# EAGLE design RAMPS_18 (EAGLE 7.3.0)
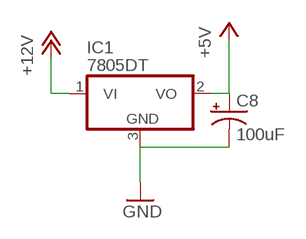
[diagram p0: schematic, sheet 1, part 1 of 2]
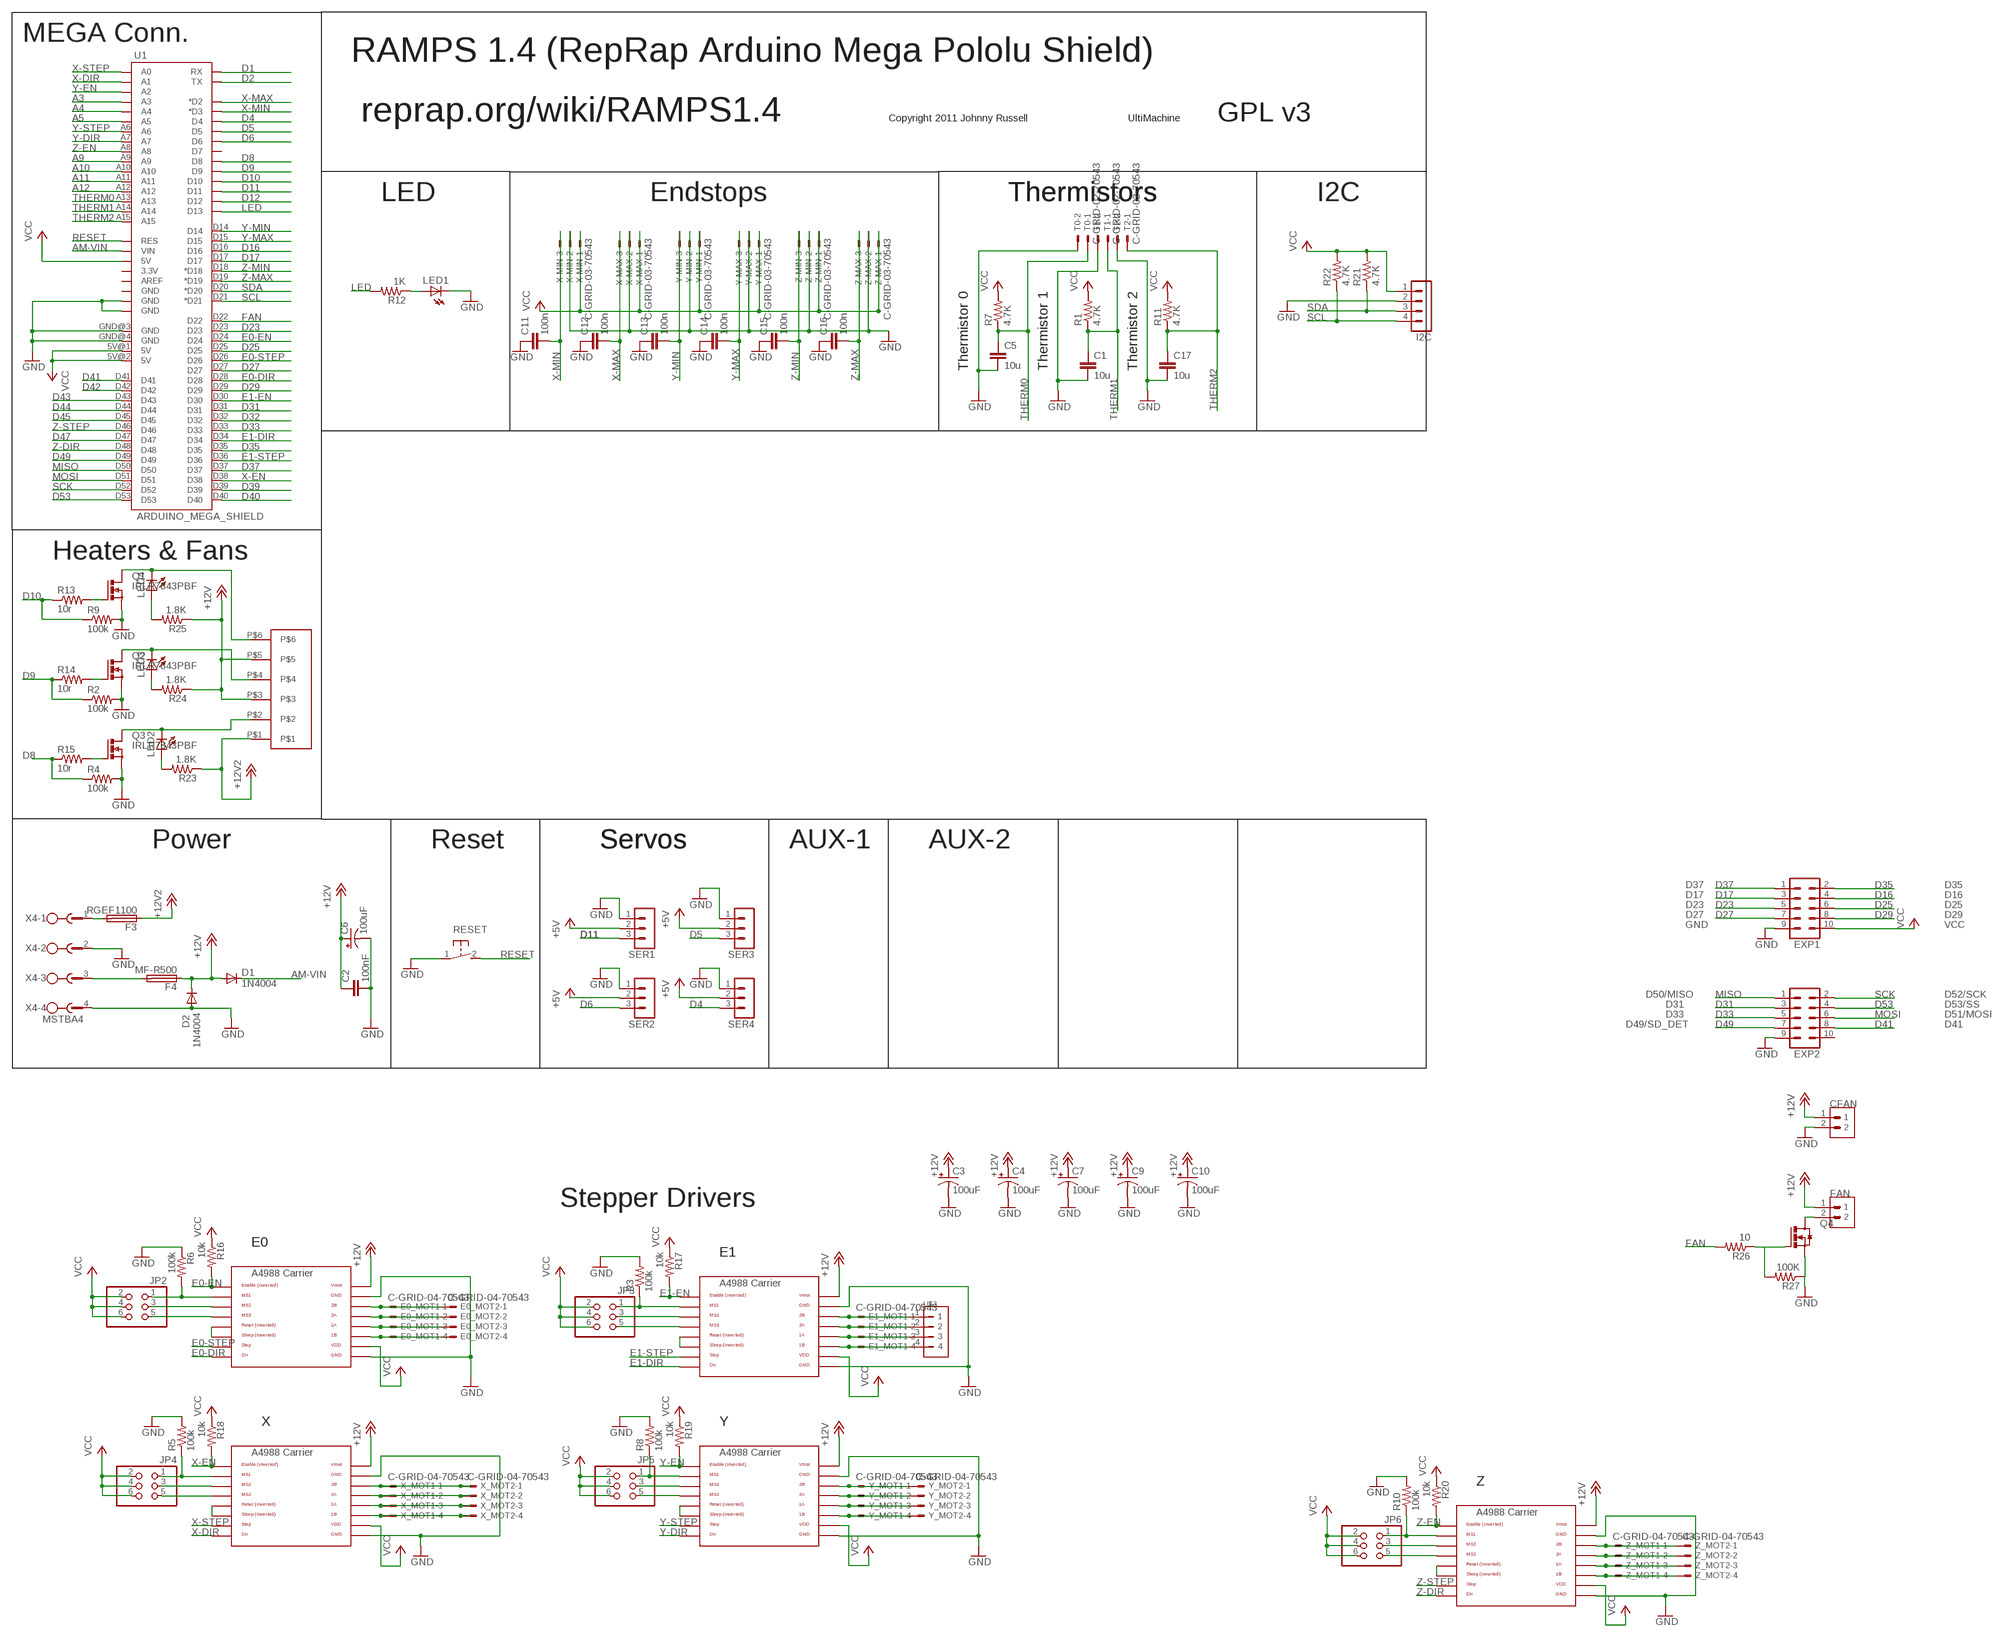
[diagram p1: schematic, sheet 1, part 2 of 2]

## Parts
C1  10u  C-EUC1206  [C1206]
C2  100nF  C-EUC0805  [C0805]
C3  100uF  CPOL-US153CLV-0605  [153CLV-0605]
C4  100uF  CPOL-US153CLV-0605  [153CLV-0605]
C5  10u  C-EUC1206  [C1206]
C6  100uF  CPOL-US153CLV-0605  [153CLV-0605]
C7  100uF  CPOL-US153CLV-0605  [153CLV-0605]
C8  100uF  CPOL-US153CLV-0605  [153CLV-0605]
C9  100uF  CPOL-US153CLV-0605  [153CLV-0605]
C10  100uF  CPOL-US153CLV-0605  [153CLV-0605]
C11  100n  C-EUC0805  [C0805]
C12  100n  C-EUC0805  [C0805]
C13  100n  C-EUC0805  [C0805]
C14  100n  C-EUC0805  [C0805]
C15  100n  C-EUC0805  [C0805]
C16  100n  C-EUC0805  [C0805]
C17  10u  C-EUC1206  [C1206]
CFAN  CWF-2_D  [CWF-2_P]
D1  1N4004  [DO41-10]
D2  1N4004  [DO41-10]
E0_MOT1  C-GRID-04-70543  [70543-04]
E0_MOT2  C-GRID-04-70543  [70543-04]
E1_MOT1  C-GRID-04-70543  [70543-04]
EXP1  MA05-2  [PAK100/2500-10]
EXP2  MA05-2  [PAK100/2500-10]
F3  RGEF1100  [RGEF1100]
F4  MF-R500  [MF-R500]
FAN  CWF-2_D  [CWF-2_P]
HEAT_PORT  282837-6  [282837-6]
I2C  MA04-1  [MA04-1]
IC1  7805DT  [TO252]
JP2  PINHD-2X3  [2X03]
JP3  PINHD-2X3  [2X03]
JP4  PINHD-2X3  [2X03]
JP5  PINHD-2X3  [2X03]
JP6  PINHD-2X3  [2X03]
LED1  LEDCHIP-LED0805  [CHIP-LED0805]
LED2  LEDCHIP-LED0805  [CHIP-LED0805]
LED3  LEDCHIP-LED0805  [CHIP-LED0805]
LED4  LEDCHIP-LED0805  [CHIP-LED0805]
Q1  IRLR7843PBF  D-PAK_N-MOSFET  [D-PAK_TO252AA]
Q2  IRLR7843PBF  D-PAK_N-MOSFET  [D-PAK_TO252AA]
Q3  IRLR7843PBF  D-PAK_N-MOSFET  [D-PAK_TO252AA]
Q4  N_MOSFET_SOT23  [SOT23]
R1  4.7K  R-US_R1206  [R1206]
R2  100k  R-US_R0805  [R0805]
R3  100k  R-US_R1206  [R1206]
R4  100k  R-US_R0805  [R0805]
R5  100k  R-US_R1206  [R1206]
R6  100k  R-US_R1206  [R1206]
R7  4.7K  R-US_R1206  [R1206]
R8  100k  R-US_R1206  [R1206]
R9  100k  R-US_R0805  [R0805]
R10  100k  R-US_R1206  [R1206]
R11  4.7K  R-US_R1206  [R1206]
R12  1K  R-US_R0805  [R0805]
R13  10r  R-US_R0805  [R0805]
R14  10r  R-US_M0805  [M0805]
R15  10r  R-US_R0805  [R0805]
R16  10k  R-US_R1206  [R1206]
R17  10k  R-US_R1206  [R1206]
R18  10k  R-US_R1206  [R1206]
R19  10k  R-US_R1206  [R1206]
R20  10k  R-US_R1206  [R1206]
R21  4.7K  R-US_R1206  [R1206]
R22  4.7K  R-US_R1206  [R1206]
R23  1.8K  R-US_R0805  [R0805]
R24  1.8K  R-US_R0805  [R0805]
R25  1.8K  R-US_R0805  [R0805]
R26  10  R-US_R1206  [R1206]
R27  100K  R-US_R1206  [R1206]
RESET  31-XX  [B3F-31XX]
SER1  3PIN-HEADER  [3PIN-HEADER]
SER2  3PIN-HEADER  [3PIN-HEADER]
SER3  3PIN-HEADER  [3PIN-HEADER]
SER4  3PIN-HEADER  [3PIN-HEADER]
T0  C-GRID-02-70543  [70543-02]
T1  C-GRID-02-70543  [70543-02]
T2  C-GRID-02-70543  [70543-02]
U1  ARDUINO_MEGA_SHIELD  [ARDUINO_MEGA_SHIELD]
U$3  CWF-4_D  [CWF-4_P]
U$4  A4988BREAKOUT  [A4988BREAKOUT]
U$5  A4988BREAKOUT  [A4988BREAKOUT]
U$6  A4988BREAKOUT  [A4988BREAKOUT]
U$7  A4988BREAKOUT  [A4988BREAKOUT]
U$8  A4988BREAKOUT  [A4988BREAKOUT]
X4  MSTBA4  [MSTBA4]
X-MAX  C-GRID-03-70543  [70543-03]
X-MIN  C-GRID-03-70543  [70543-03]
X_MOT1  C-GRID-04-70543  [70543-04]
X_MOT2  C-GRID-04-70543  [70543-04]
Y-MAX  C-GRID-03-70543  [70543-03]
Y-MIN  C-GRID-03-70543  [70543-03]
Y_MOT1  C-GRID-04-70543  [70543-04]
Y_MOT2  C-GRID-04-70543  [70543-04]
Z-MAX  C-GRID-03-70543  [70543-03]
Z-MIN  C-GRID-03-70543  [70543-03]
Z_MOT1  C-GRID-04-70543  [70543-04]
Z_MOT2  C-GRID-04-70543  [70543-04]

## Nets
+5V: C8.+ IC1.2(VO) SER1.2 SER2.2 SER3.2 SER4.2
+12V: C2.1 C3.+ C4.+ C6.+ C7.+ C9.+ C10.+ CFAN.1 D1.A D2.C F4.P$1 FAN.1 HEAT_PORT.P$3 HEAT_PORT.P$5 IC1.1(VI) R24.1 R25.1 U$4.VMOT U$5.VMOT U$6.VMOT U$7.VMOT U$8.VMOT
+12V2: F3.P$1 HEAT_PORT.P$1 R23.1
A3: U1.A3
A4: U1.A4
A5: U1.A5
A9: U1.A9
A10: U1.A10
A11: U1.A11
A12: U1.A12
AM-VIN: D1.C U1.VIN
D1: U1.RX
D2: U1.TX
D4: SER4.3 U1.D4
D5: SER3.3 U1.D5
D6: SER2.3 U1.D6
D8: R4.1 R15.1 U1.D8
D9: R2.1 R14.1 U1.D9
D10: R9.1 R13.1 U1.D10
D11: SER1.3 U1.D11
D12: U1.D12
D16: EXP1.4 U1.D16
D17: EXP1.3 U1.D17
D23: EXP1.5 U1.D23
D25: EXP1.6 U1.D25
D27: EXP1.7 U1.D27
D29: EXP1.8 U1.D29
D31: EXP2.3 U1.D31
D32: U1.D32
D33: EXP2.5 U1.D33
D35: EXP1.2 U1.D35
D37: EXP1.1 U1.D37
D39: U1.D39
D40: U1.D40
D41: EXP2.8 U1.D41
D42: U1.D42
D43: U1.D43
D44: U1.D44
D45: U1.D45
D47: U1.D47
D49: EXP2.7 U1.D49
D53: EXP2.4 U1.D53
E0-DIR: U1.D28 U$4.DIR
E0-EN: R16.2 U1.D24 U$4.EN
E0-STEP: U1.D26 U$4.STEP
E1-DIR: U1.D34 U$5.DIR
E1-EN: R17.2 U1.D30 U$5.EN
E1-STEP: U1.D36 U$5.STEP
FAN: R26.2 U1.D22
GND: C1.2 C2.2 C3.- C4.- C5.2 C6.- C7.- C8.- C9.- C10.- C11.1 C12.1 C13.1 C14.1 C15.1 C16.1 C17.2 CFAN.2 D2.A EXP1.9 EXP2.9 I2C.2 IC1.3(GND) LED1.C Q1.3(S) Q2.3(S) Q3.3(S) Q4.2(S) R2.2 R3.2 R4.2 R5.2 R6.1 R8.2 R9.2 R10.2 R27.1 RESET.1(P) SER1.1 SER2.1 SER3.1 SER4.1 T0.2 T1.2 T2.2 U1.GND@0(GND) U1.GND@1(GND) U1.GND@3(GND) U1.GND@4(GND) U$4.GND U$4.GND@0(GND) U$5.GND U$5.GND@0(GND) U$6.GND U$6.GND@0(GND) U$7.GND U$7.GND@0(GND) U$8.GND U$8.GND@0(GND) X4.2 X4.4 X-MAX.2 X-MIN.2 Y-MAX.2 Y-MIN.2 Z-MAX.2 Z-MIN.2
LED: R12.2 U1.D13
MISO: EXP2.1 U1.D50
MOSI: EXP2.6 U1.D51
N$1: HEAT_PORT.P$4 LED3.C Q2.4(D)
N$3: E0_MOT1.1 E0_MOT2.1 U$4.2B
N$4: E0_MOT1.2 E0_MOT2.2 U$4.2A
N$5: JP2.1 R6.2 U$4.MS1
N$6: JP2.5 U$4.MS3
N$7: HEAT_PORT.P$6 LED4.C Q1.4(D)
N$8: U$4.RST U$4.SLP(SLEEP)
N$9: JP2.3 U$4.MS2
N$10: E0_MOT1.3 E0_MOT2.3 U$4.1A
N$11: E0_MOT1.4 E0_MOT2.4 U$4.1B
N$12: E1_MOT1.1 U$3.1 U$5.2B
N$13: E1_MOT1.2 U$3.2 U$5.2A
N$14: JP4.1 R5.1 U$6.MS1
N$15: JP4.3 U$6.MS2
N$16: E1_MOT1.3 U$3.3 U$5.1A
N$17: JP5.3 U$7.MS2
N$18: E1_MOT1.4 U$3.4 U$5.1B
N$19: JP4.5 U$6.MS3
N$20: U$6.RST U$6.SLP(SLEEP)
N$21: U$6.2B X_MOT1.1 X_MOT2.1
N$22: U$6.2A X_MOT1.2 X_MOT2.2
N$23: U$7.RST U$7.SLP(SLEEP)
N$24: U$5.RST U$5.SLP(SLEEP)
N$25: JP3.1 R3.1 U$5.MS1
N$26: U$6.1A X_MOT1.3 X_MOT2.3
N$27: U$6.1B X_MOT1.4 X_MOT2.4
N$28: U$7.2B Y_MOT1.1 Y_MOT2.1
N$29: U$7.2A Y_MOT1.2 Y_MOT2.2
N$30: U$7.1A Y_MOT1.3 Y_MOT2.3
N$31: JP5.5 U$7.MS3
N$32: LED2.A R23.2
N$33: JP5.1 R8.1 U$7.MS1
N$34: JP3.5 U$5.MS3
N$35: JP3.3 U$5.MS2
N$36: U$7.1B Y_MOT1.4 Y_MOT2.4
N$37: JP6.3 U$8.MS2
N$38: U$8.RST U$8.SLP(SLEEP)
N$39: JP6.5 U$8.MS3
N$40: JP6.1 R10.1 U$8.MS1
N$41: U$8.2B Z_MOT1.1 Z_MOT2.1
N$42: U$8.2A Z_MOT1.2 Z_MOT2.2
N$43: U$8.1A Z_MOT1.3 Z_MOT2.3
N$44: U$8.1B Z_MOT1.4 Z_MOT2.4
N$45: LED3.A R24.2
N$46: LED1.A R12.1
N$47: Q2.1(G) R14.2
N$48: Q1.1(G) R13.2
N$49: Q3.1(G) R15.2
N$50: LED4.A R25.2
N$51: HEAT_PORT.P$2 LED2.C Q3.4(D)
N$53: F3.P$2 X4.1
N$54: F4.P$2 X4.3
N$62: FAN.2 Q4.3(D)
N$63: Q4.1(G) R26.1 R27.2
RESET: RESET.2(S) U1.RES
SCK: EXP2.2 U1.D52
SCL: I2C.4 R22.1 U1.D21(*D21)
SDA: I2C.3 R21.1 U1.D20(*D20)
THERM0: C5.1 R7.1 T0.1 U1.A13
THERM1: C1.1 R1.1 T1.1 U1.A14
THERM2: C17.1 R11.1 T2.1 U1.A15
VCC: EXP1.10 I2C.1 JP2.2 JP2.4 JP2.6 JP3.2 JP3.4 JP3.6 JP4.2 JP4.4 JP4.6 JP5.2 JP5.4 JP5.6 JP6.2 JP6.4 JP6.6 R1.2 R7.2 R11.2 R16.1 R17.1 R18.1 R19.1 R20.1 R21.2 R22.2 U1.5V@0(5V) U1.5V@1(5V) U1.5V@2(5V) U$4.VDD U$5.VDD U$6.VDD U$7.VDD U$8.VDD X-MAX.1 X-MIN.1 Y-MAX.1 Y-MIN.1 Z-MAX.1 Z-MIN.1
X-DIR: U1.A1 U$6.DIR
X-EN: R18.2 U1.D38 U$6.EN
X-MAX: C12.2 U1.D2(*D2) X-MAX.3
X-MIN: C11.2 U1.D3(*D3) X-MIN.3
X-STEP: U1.A0 U$6.STEP
Y-DIR: U1.A7 U$7.DIR
Y-EN: R19.2 U1.A2 U$7.EN
Y-MAX: C14.2 U1.D15 Y-MAX.3
Y-MIN: C13.2 U1.D14 Y-MIN.3
Y-STEP: U1.A6 U$7.STEP
Z-DIR: U1.D48 U$8.DIR
Z-EN: R20.2 U1.A8 U$8.EN
Z-MAX: C16.2 U1.D19(*D19) Z-MAX.3
Z-MIN: C15.2 U1.D18(*D18) Z-MIN.3
Z-STEP: U1.D46 U$8.STEP
Unconnected: EXP2.10 U1.3.3V U1.AREF U1.D7 U1.GND@2(GND)

## Notes on the sheet
- MEGA Conn.
- RAMPS 1.4 (RepRap Arduino Mega Pololu Shield)
- reprap.org/wiki/RAMPS1.4 | Copyright 2011 Johnny Russell | UltiMachine | GPL v3
- LED | Endstops | Thermistors | Thermistors | I2C
- Thermistor 0 | Thermistor 1 | Thermistor 2
- Heaters & Fans
- Power | Reset | Servos | Servos | AUX-1 | AUX-2
- D37 | D35
- D17 | D16
- D23 | D25
- D27 | D29
- GND | VCC
- D50/MISO | D52/SCK
- D31 | D53/SS
- D33 | D51/MOSI
- D49/SD_DET | D41
- Stepper Drivers
- E0
- E1
- X | Y
- Z

## Library data of the parts
C1 C2 C5 C17 = resistor:C-EU: CAPACITOR, European symbol
C3 C4 C6-C10 = adafruit:CPOL-US: POLARIZED CAPACITOR, American symbol
C11-C16 = rcl:C-EU: CAPACITOR, European symbol
CFAN FAN = xSets - Joystick:CWF-2_D
D1 D2 = diode:1N4004: DIODE general purpose rectifier, 1 A
E0_MOT1 E0_MOT2 E1_MOT1 X_MOT1 X_MOT2 Y_MOT1 Y_MOT2 Z_MOT1 Z_MOT2 = con-molex:C-GRID-04: CONNECTOR wire to board 2.54 mm (0.100") pitch header; OC_FARNELL: unknown; OC_NEWARK: unknown
EXP1 EXP2 = xSets - Joystick:MA05-2: PIN HEADER
F3 = xSets - Joystick:RGEF1100
F4 = xSets - Joystick:MF-R500
HEAT_PORT = RepRapjr:282837-6
I2C = con-lstb:MA04-1: PIN HEADER; OC_FARNELL: unknown; OC_NEWARK: unknown
IC1 = linear:78*: Positive VOLTAGE REGULATOR Source: http://cache.national.com/ds/LM/LM78L05.pdf http://www.fairchildsemi.com/ds/LM/LM7805.pdf
JP2-JP6 = pinhead:PINHD-2X3: PIN HEADER
LED1-LED4 = led:LED: LED OSRAM: - CHIPLED LG R971, LG N971, LY N971, LG Q971, LY Q971, LO R971, LY R971 LH N974, LH R974 LS Q976, LO Q976, LY Q976 LO Q996 - Hyper CHIPLED LW Q18S LB Q993, LB Q99A, LB R99A - SideLED LS A670, LO A670, LY A670, LG A670, LP A670 LB A673, LV A673, LT A673, LW A673 LH A674 LY A675 LS A676, LA A676, LO A676, LY A676, LW A676 LS A679, LY A679, LG A679 - Hyper Micro SIDELED® LS Y876, LA Y876, LO Y876, LY Y876 LT Y87S - SmartLED LW L88C, LW L88S LB L89C, LB L89S, LG L890 LS L89K, LO L89K, LY L89K LS L896, LA L896, LO L896, LY L896 - TOPLED LS T670, LO T670, LY T670, LG T670, LP T670 LSG T670, LSP T670, LSY T670, LOP T670, LYG T670 LG T671, LOG T671, LSG T671 LB T673, LV T673, LT T673, LW T673 LH T674 LS T676, LA T676, LO T676, LY T676, LB T676, LH T676, LSB T676, LW T676 LB T67C, LV T67C, LT T67C, LS T67K, LO T67K, LY T67K, LW E67C LS E67B, LA E67B, LO E67B, LY E67B, LB E67C, LV E67C, LT E67C LW T67C LS T679, LY T679, LG T679 LS T770, LO T770, LY T770, LG T770, LP T770 LB T773, LV T773, LT T773, LW T773 LH T774 LS E675, LA E675, LY E675, LS T675 LS T776, LA T776, LO T776, LY T776, LB T776 LHGB T686 LT T68C, LB T68C - Hyper Mini TOPLED® LB M676 - Mini TOPLED Santana® LG M470 LS M47K, LO M47K, LY M47K Source: http://www.osram.convergy.de LUXEON: - LUMILED® LXK2-PW12-R00, LXK2-PW12-S00, LXK2-PW14-U00, LXK2-PW14-V00 LXK2-PM12-R00, LXK2-PM12-S00, LXK2-PM14-U00 LXK2-PE12-Q00, LXK2-PE12-R00, LXK2-PE12-S00, LXK2-PE14-T00, LXK2-PE14-U00 LXK2-PB12-K00, LXK2-PB12-L00, LXK2-PB12-M00, LXK2-PB14-N00, LXK2-PB14-P00, LXK2-PB14-Q00 LXK2-PR12-L00, LXK2-PR12-M00, LXK2-PR14-Q00, LXK2-PR14-R00 LXK2-PD12-Q00, LXK2-PD12-R00, LXK2-PD12-S00 LXK2-PH12-R00, LXK2-PH12-S00 LXK2-PL12-P00, LXK2-PL12-Q00, LXK2-PL12-R00 Source: www.luxeon.com KINGBRIGHT: KA-3528ASYC Source: www.kingbright.com
Q1-Q3 = xSets - Joystick:D-PAK_N-MOSFET
Q4 = vProjects - PowerWall:N_MOSFET
R1-R12 R16-R27 = adafruit:R-US_: RESISTOR, American symbol
R13-R15 = resistor:R-US_: RESISTOR, American symbol
RESET = switch-omron:31-XX: OMRON SWITCH; MPN: B3F-3100; OC_FARNELL: 959704; OC_NEWARK: 36M3582
SER1-SER4 = ultimachine:3PIN-HEADER: PIN HEADER
T0 T1 T2 = con-molex:C-GRID-02: CONNECTOR wire to board 2.54 mm (0.100") pitch header; OC_FARNELL: unknown; OC_NEWARK: unknown
U1 = RepRapjr:ARDUINO_MEGA_SHIELD
U$3 = xSets - Joystick:CWF-4_D
U$4-U$8 = RepRapjr:A4988BREAKOUT
X4 = con-phoenix-508:MSTBA4: PHOENIX; MF: FARNELL; MPN: 1757268; OC_FARNELL: 3705195; OC_NEWARK: 71C4163
X-MAX X-MIN Y-MAX Y-MIN Z-MAX Z-MIN = con-molex:C-GRID-03: CONNECTOR wire to board 2.54 mm (0.100") pitch header; OC_FARNELL: unknown; OC_NEWARK: unknown

## Board
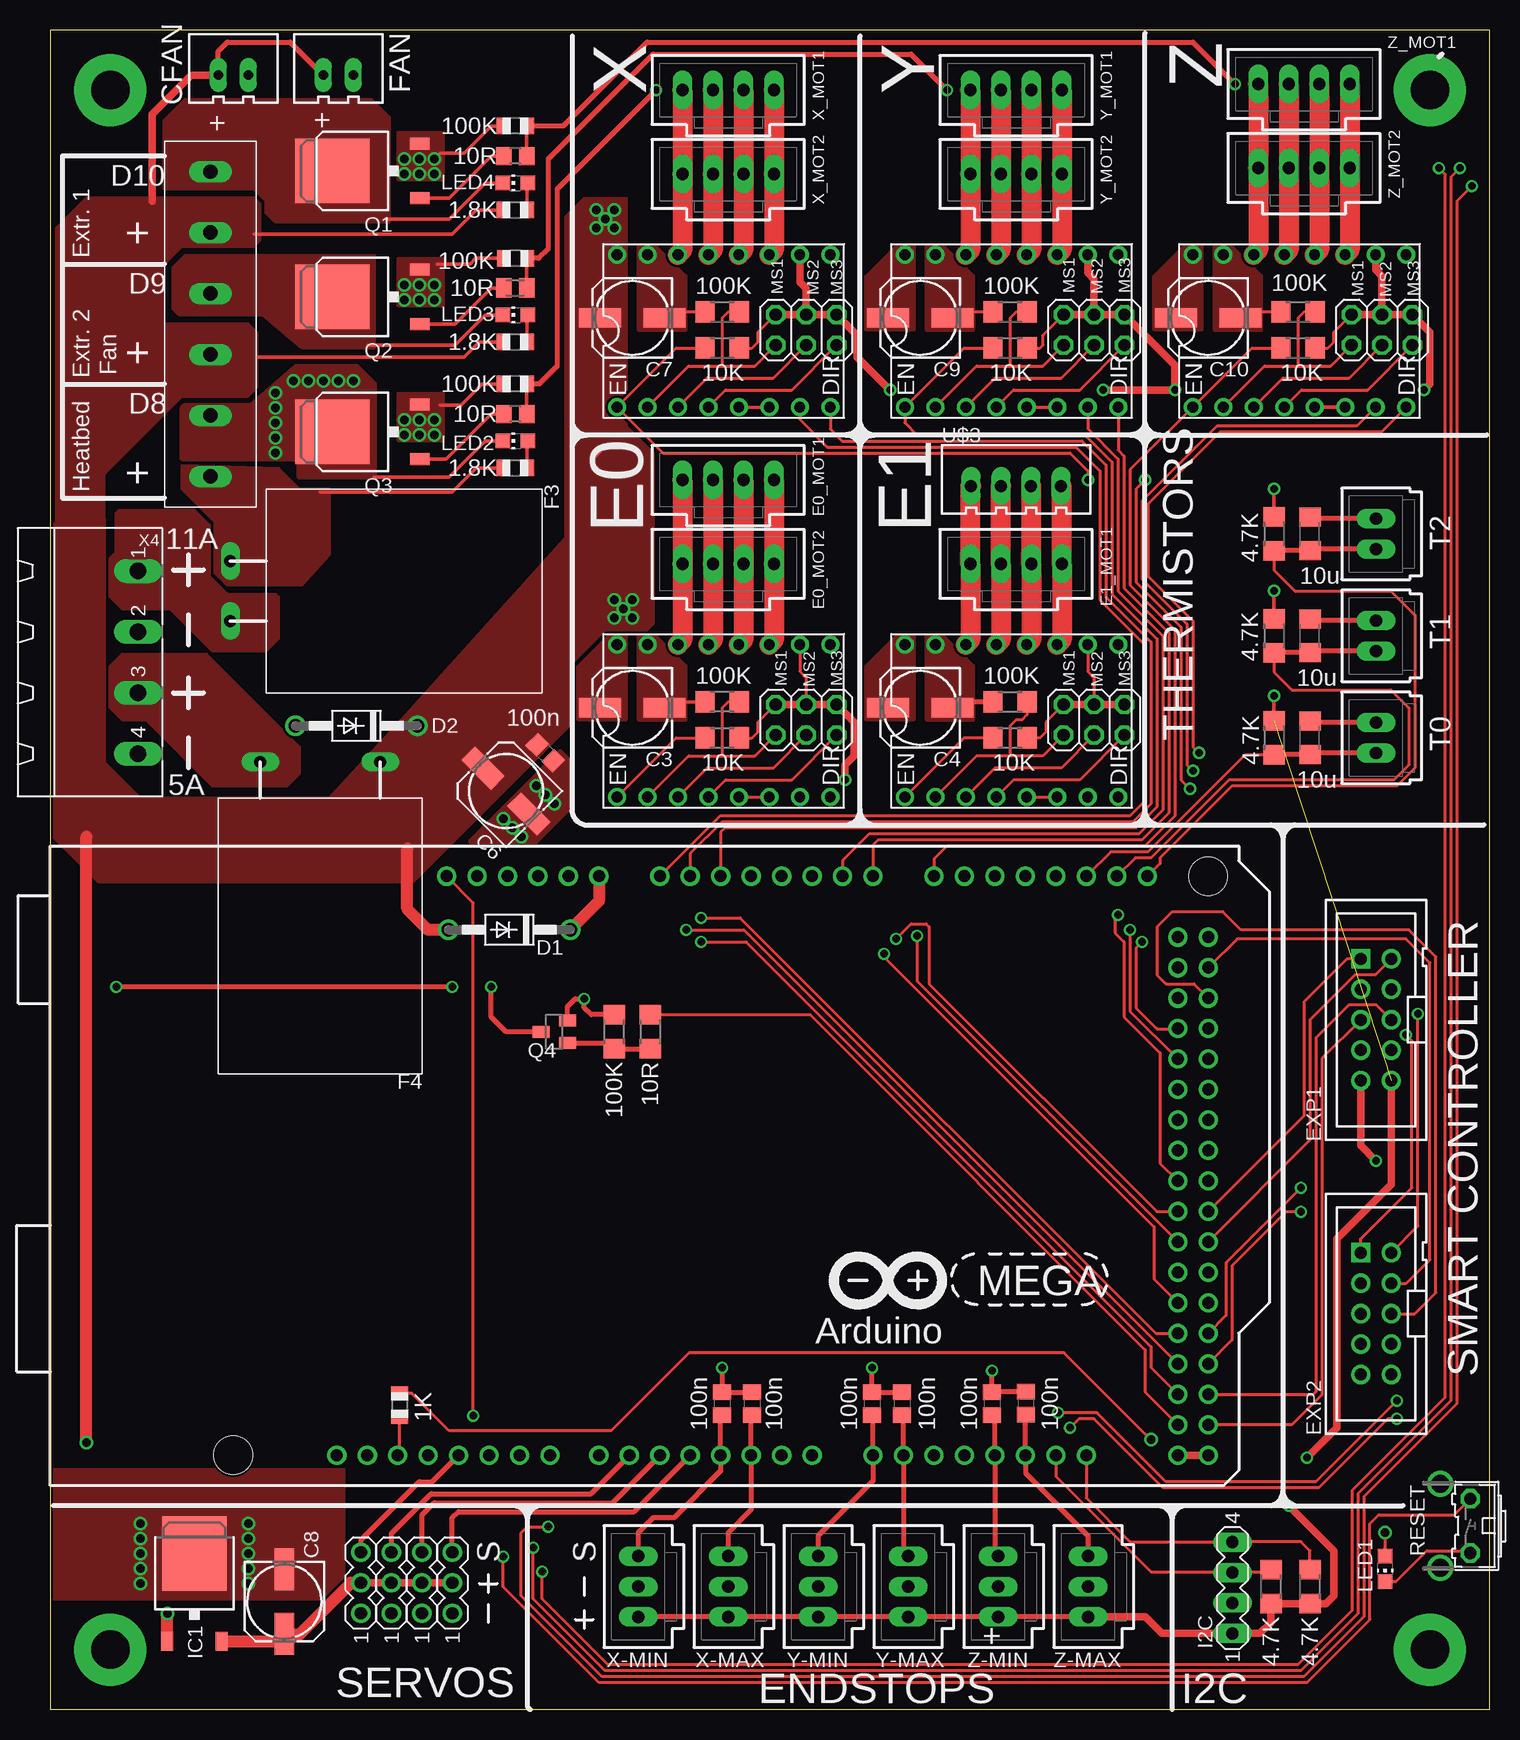
[diagram p2: board, top side]
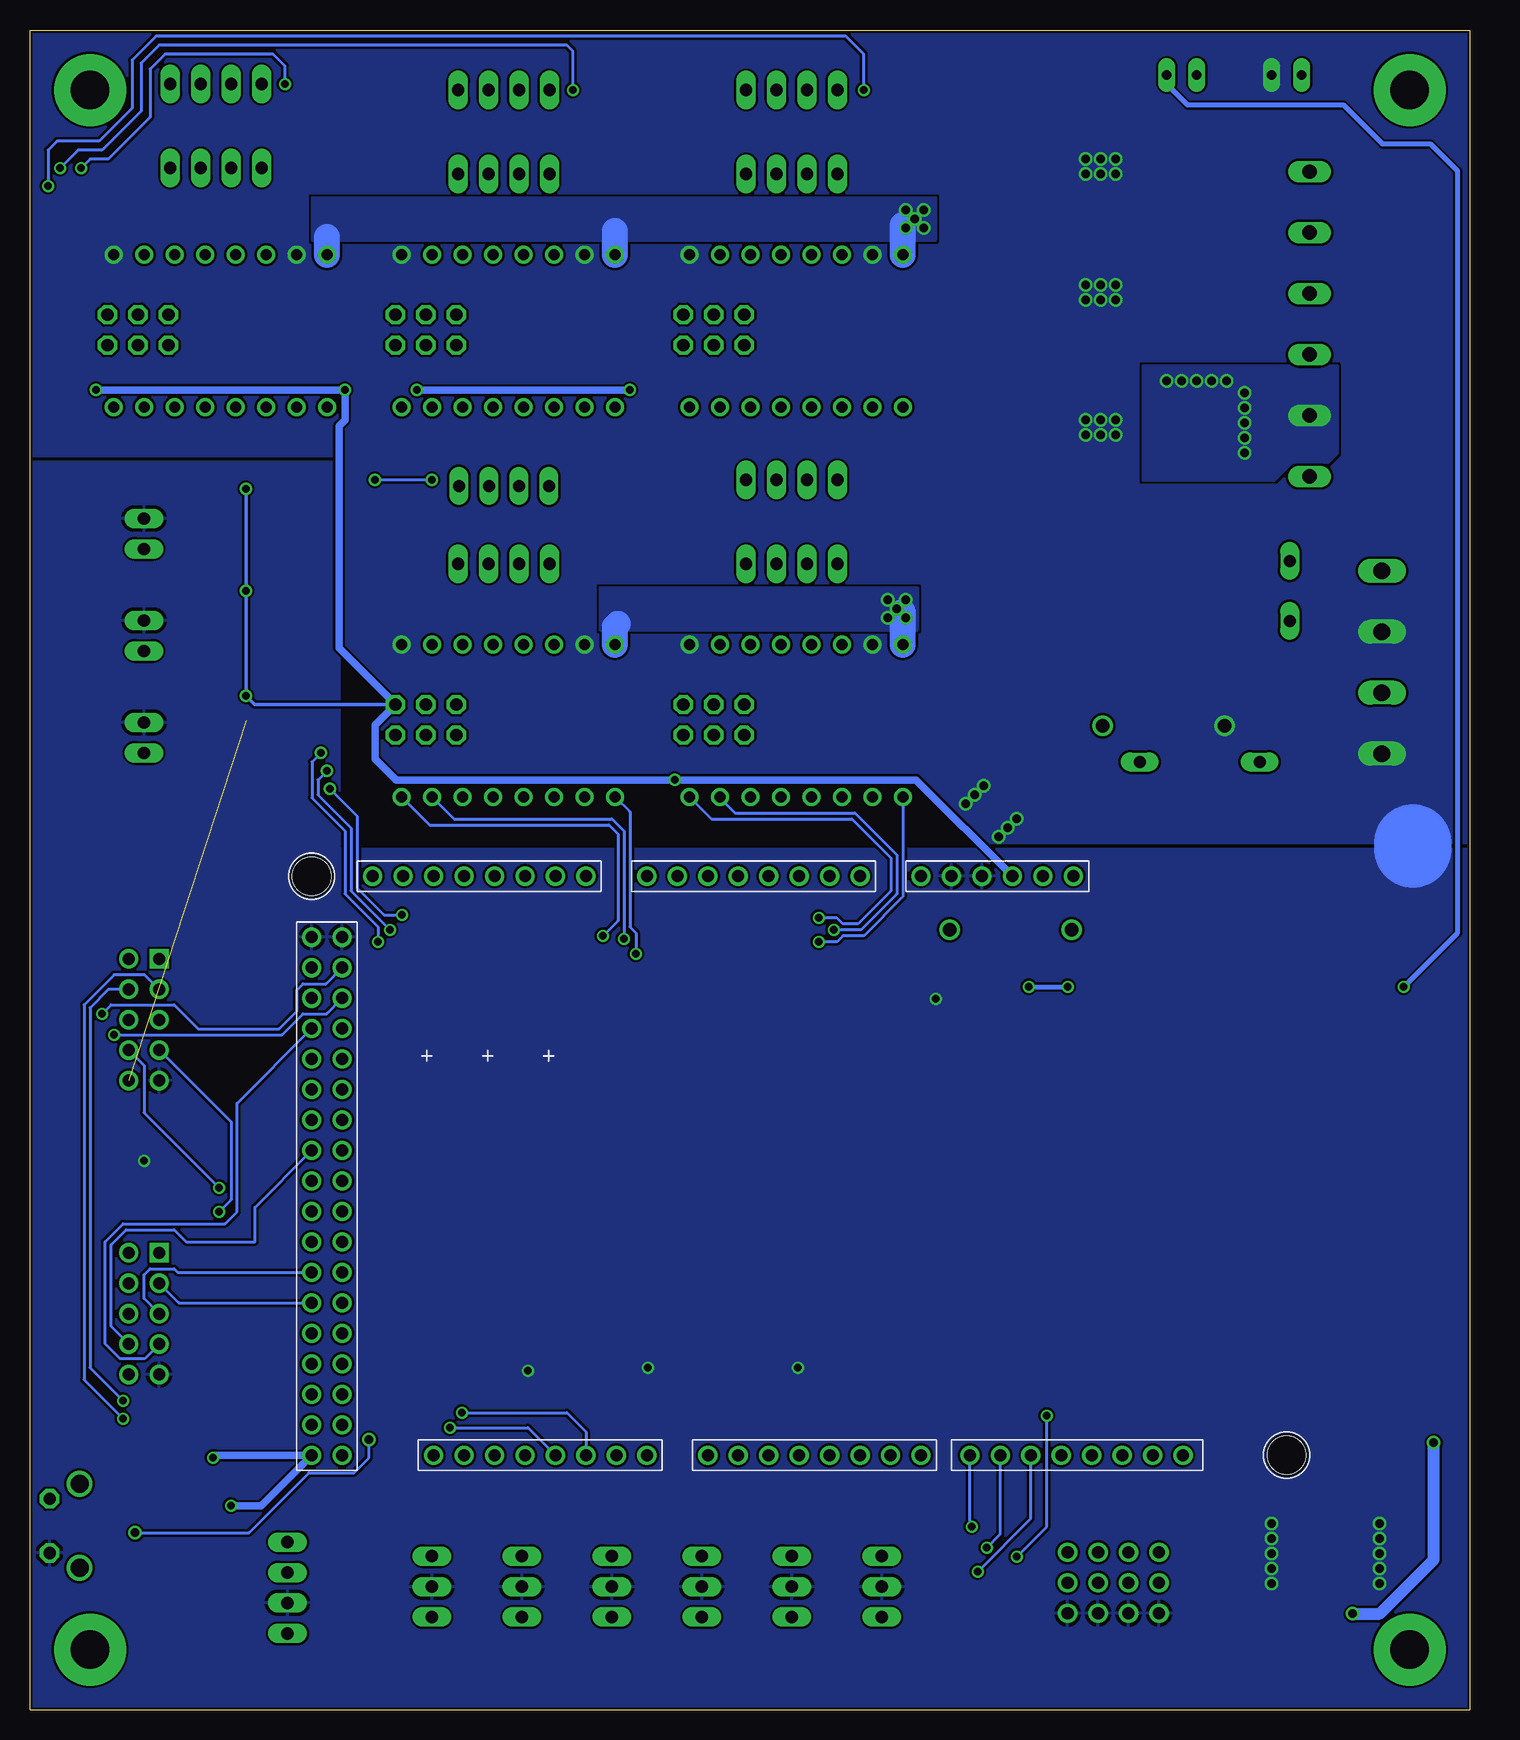
[diagram p3: board, bottom side, seen from below]

Size 120 x 140 mm. Coordinates in mm from the lower left corner, seen from the top.
Outline: 120,0 120,140 0,140 0,0 120,0
Copper layers (1*16): Top 0.035mm / dielectric 1.6mm / Bottom 0.035mm
Design rules "PCB-CART *": minimum track width 0.2mm, minimum drill 0.4mm, track to track 0.2mm, track to pad 0.2mm, pad to pad 0.2mm, via to via 0.2mm, smd to smd 0.2mm, copper to edge 0.2mm, drill to drill 0.2mm, minimum pad ring 0.3mm, minimum via ring 0.2mm, stop-mask expansion 3mil, vias tented up to drill 0.7mm, thermal gap 12mil
bRestrict: 3 lines

### Footprints (pad centres in the part's own frame; a part is rotated, then mirrored left to right if it is on the bottom)
C1206 = smd 1.6 x 1.8: 1 -1.4,0; 2 1.4,0
C0805 = smd 1.3 x 1.5: 1 -0.95,0; 2 0.95,0
153CLV-0605 = smd 3.5 x 1.6: + 2.7,0; - -2.7,0
CWF-2_P = drill 0.8 long: 1 -1.25,0; 2 1.25,0
DO41-10 = drill 1.118: A 5.08,0; C -5.08,0
70543-04 = drill 1.016 long: 1 -3.81,0; 2 -1.27,0; 3 1.27,0; 4 3.81,0
PAK100/2500-10 = drill 1 pad 1.55 square: 1 5.08,1.27 | drill 1 pad 1.55: 2 5.08,-1.27; 3 2.54,1.27; 4 2.54,-1.27; 5 0,1.27; 6 0,-1.27; 7 -2.54,1.27; 8 -2.54,-1.27; 9 -5.08,1.27; 10 -5.08,-1.27
RGEF1100 = drill 1 long: P$1 -2.5,-2; P$2 2.5,-2
MF-R500 = drill 1 long: P$1 -5,-2; P$2 5,-2
282837-6 = drill 1.2 long: P$1 0,-12.7; P$2 0,-7.62; P$3 0,-2.54; P$4 0,2.54; P$5 0,7.62; P$6 0,12.7
MA04-1 = drill 1.016 long: 1 -3.81,0; 2 -1.27,0; 3 1.27,0; 4 3.81,0
TO252 = smd 1 x 1.6: 1 -2.28,-4.8; 2 2.28,-4.8 | smd 5.4 x 6.2: 3 0,2.5
2X03 = drill 1.016 octagon: 1 -2.54,-1.27; 2 -2.54,1.27; 3 0,-1.27; 4 0,1.27; 5 2.54,-1.27; 6 2.54,1.27
CHIP-LED0805 = smd 1.2 x 1.2: A 0,-1.05; C 0,1.05
D-PAK_TO252AA = smd 1 x 1.6: 1 -2.28,-4.8; 3 2.28,-4.8 | smd 5.4 x 6.2: 4 0,2.5
SOT23 = smd 1 x 1.4: 1 -0.95,-1.1; 2 0.95,-1.1; 3 0,1.1
R1206 = smd 1.6 x 1.803: 1 -1.422,0; 2 1.422,0
R0805 = smd 1.1 x 1.4: 1 -1,0; 2 1,0
R0805' = smd 1.3 x 1.5: 1 -0.95,0; 2 0.95,0
M0805 = smd 1.3 x 1.6: 1 -0.95,0; 2 0.95,0
B3F-31XX = drill 1.016 octagon: 1 -2.261,-1.245; 2 2.261,-1.245 | drill 1.499 pad 2.159: 3 -3.505,1.245; 4 3.505,1.245
3PIN-HEADER = drill 1.016: 1 -2.54,0; 2 0,0; 3 2.54,0
70543-02 = drill 1.016 long: 1 -1.27,0; 2 1.27,0
ARDUINO_MEGA_SHIELD = drill 1 pad 1.422: 3.3V 35.56,2.54; 5V@0 38.1,2.54; 5V@1 93.98,50.8; 5V@2 96.52,50.8; A0 50.8,2.54; A1 53.34,2.54; A2 55.88,2.54; A3 58.42,2.54; A4 60.96,2.54; A5 63.5,2.54; A6 66.04,2.54; A7 68.58,2.54; A8 73.66,2.54; A9 76.2,2.54; A10 78.74,2.54; A11 81.28,2.54; A12 83.82,2.54; A13 86.36,2.54; A14 88.9,2.54; A15 91.44,2.54; AREF 23.876,50.8; D2 58.42,50.8; D3 55.88,50.8; D4 53.34,50.8; D5 50.8,50.8; D6 48.26,50.8; D7 45.72,50.8; D8 41.656,50.8; D9 39.116,50.8; D10 36.576,50.8; D11 34.036,50.8; D12 31.496,50.8; D13 28.956,50.8; D14 68.58,50.8; D15 71.12,50.8; D16 73.66,50.8; D17 76.2,50.8; D18 78.74,50.8; D19 81.28,50.8; D20 83.82,50.8; D21 86.36,50.8; D22 93.98,48.26; D23 96.52,48.26; D24 93.98,45.72; D25 96.52,45.72; D26 93.98,43.18; D27 96.52,43.18; D28 93.98,40.64; D29 96.52,40.64; D30 93.98,38.1; D31 96.52,38.1; D32 93.98,35.56; D33 96.52,35.56; D34 93.98,33.02; D35 96.52,33.02; D36 93.98,30.48; D37 96.52,30.48; D38 93.98,27.94; D39 96.52,27.94; D40 93.98,25.4; D41 96.52,25.4; D42 93.98,22.86; D43 96.52,22.86; D44 93.98,20.32; D45 96.52,20.32; D46 93.98,17.78; D47 96.52,17.78; D48 93.98,15.24; D49 96.52,15.24; D50 93.98,12.7; D51 96.52,12.7; D52 93.98,10.16; D53 96.52,10.16; GND@0 40.64,2.54; GND@1 43.18,2.54; GND@2 26.416,50.8; GND@3 93.98,7.62; GND@4 96.52,7.62; RES 33.02,2.54; RX 63.5,50.8; TX 60.96,50.8; VIN 45.72,2.54 | hole 3.2: 96.52,2.54; 15.24,50.8
CWF-4_P = drill 1 long: 1 -3.75,0; 2 -1.25,0; 3 1.25,0; 4 3.75,0
A4988BREAKOUT = drill 0.9: 1A 8.89,1.27; 1B 11.43,1.27; 2A 6.35,1.27; 2B 3.81,1.27; DIR 16.51,-11.43; EN -1.27,-11.43; GND 16.51,1.27; GND@0 1.27,1.27; MS1 1.27,-11.43; MS2 3.81,-11.43; MS3 6.35,-11.43; RST 8.89,-11.43; SLP 11.43,-11.43; STEP 13.97,-11.43; VDD 13.97,1.27; VMOT -1.27,1.27
MSTBA4 = drill 1.397 long: 1 -7.62,5.08; 2 -2.54,5.08; 3 2.54,5.08; 4 7.62,5.08
70543-03 = drill 1.016 long: 1 -2.54,0; 2 0,0; 3 2.54,0

### Placement (x,y rotation side)
C1  105,89.5 90 top
C2  41.25,79.75 315 top
C3  48.5,83.5 180 top
C4  72.5,83.5 180 top
C5  105,81 90 top
C6  37.98,76.56 135 top
C7  48.5,116 180 top
C8  19.5,9 270 top
C9  72.5,116 180 top
C10  96.5,116 180 top
C11  56,25.5 270 top
C12  58.5,25.5 270 top
C13  68.5,25.5 270 top
C14  71,25.5 270 top
C15  78.5,25.5 270 top
C16  81.3,25.55 270 top
C17  105,98 90 top
CFAN  15.25,136.25 0 top
D1  38.25,65 180 top
D2  25.5,82 180 top
E0_MOT1  56.5,102.5 0 top
E0_MOT2  56.5,95.5 0 top
E1_MOT1  80.5,95.5 0 top
EXP1  110.5,57.5 90 top
EXP2  110.5,33 90 top
F3  17,93.25 270 top
F4  22.5,77 180 top
FAN  24,136.25 0 top
HEAT_PORT  13.34,115.49 0 top
I2C  98.53,10.15 90 top
IC1  12,10.5 0 top
JP2  63,82.5 0 top
JP3  87,82.5 0 top
JP4  63,115 0 top
JP5  87,115 0 top
JP6  111,115 0 top
LED1  111.27,11.73 180 top
LED2  38.75,105.75 90 top
LED3  38.75,116.25 90 top
LED4  38.75,127.25 90 top
Q1  26,128.25 90 top
Q2  26,117.75 90 top
Q3  26,106.5 90 top
Q4  42,56.5 90 top
R1  102,89.5 90 top
R2  38.77,120.96 180 top
R3  80,84 180 top
R4  38.75,110.5 180 top
R5  56,116.5 180 top
R6  56,84 0 top
R7  102,81 90 top
R8  80,116.5 180 top
R9  38.75,132 180 top
R10  104,116.5 180 top
R11  102,98 90 top
R12  29.11,25.37 270 top
R13  10r  [R0805']  38.75,129.5 180 top
R14  38.75,118.5 180 top
R15  10r  [R0805']  38.75,108 180 top
R16  56,81 180 top
R17  80,81 180 top
R18  56,113.5 180 top
R19  80,113.5 180 top
R20  104,113.5 180 top
R21  101.75,10.25 270 top
R22  105,10.25 270 top
R23  38.75,103.5 0 top
R24  38.75,114 0 top
R25  38.75,125 0 top
R26  50,56.5 90 top
R27  47,56.5 270 top
RESET  117.12,15.31 90 top
SER1  25.89,10.56 90 top
SER2  28.43,10.56 90 top
SER3  30.97,10.56 90 top
SER4  33.51,10.56 90 top
T0  110.5,81 90 top
T1  110.5,89.5 90 top
T2  110.5,98 90 top
U1  0,72 180 bottom
U$3  80.5,102 0 top
U$4  48.5,87.5 0 top
U$5  72.5,87.5 0 top
U$6  48.5,120 0 top
U$7  72.5,120 0 top
U$8  96.5,120 0 top
X4  2.22,87.3 270 top
X-MAX  56.5,10.25 90 top
X-MIN  49,10.25 90 top
X_MOT1  56.5,135 0 top
X_MOT2  56.5,128 0 top
Y-MAX  71.5,10.25 90 top
Y-MIN  64,10.25 90 top
Y_MOT1  80.5,135 0 top
Y_MOT2  80.5,128 0 top
Z-MAX  86.5,10.25 90 top
Z-MIN  79,10.25 90 top
Z_MOT1  104.5,135.5 0 top
Z_MOT2  104.5,128.5 0 top

### Tracks (layer width: path | path; a pad name or v marks a point on that pad's centre or on a via)
+5V
  Top 0.61: SER1.2 | SER1.2 SER2.2 SER3.2 SER4.2
  Top 1.016: SER1.2 25.07,10.56 20.75,6.25 19.55,6.25 C8.+ 18.9,5.7 IC1.2
+12V  (via drill 0.7)
  Top 0.254: 45.8,104.8 45.5,104.5
  Top 0.305: R24.1 35.75,114 34.5,112.75 17.25,112.75 | R25.1 35.5,125 33.5,123 17,123
  Top 0.406: CFAN.1 14,138.25 14.75,139 20,139 FAN.1
  Top 0.61: CFAN.1 11.75,136.25 8.5,133 8.5,125.75
  Top 1.016: IC1.1 9.75,5.73 v9.75,8 | v3,22.25 3,72.75 | D1.A 31.5,65 29.75,66.75 29.75,71.75
  Bottom 0.61: U$4.VMOT arc90 47.5,89.04
  Bottom 1.016: v9.75,8 7.5,8 3,12.5 v3,22.25
  Bottom 2.184: U$4.VMOT 47.23,91.5 | U$5.VMOT 71.23,90.27 71,90.5 | U$6.VMOT 47.23,123.73 | U$7.VMOT 71.23,123.27 | U$8.VMOT 95.23,122.77
  other vias: 47,92.5 48.5,92.5 48.5,91 47,91 47,125 47,123.5 45.5,125 45.5,123.5 47.75,91.75 46.25,124.25
  pour Top (no thermals): 68,82.5 68,87 70.5,89.5 72,89.5 72,82.5
  pour Top (no thermals): 44,82.5 44,87 46.5,89.5 48,89.5 48,82.5
  pour Top (no thermals): 68,115 68,119.5 70.5,122 72,122 72,115
  pour Top (no thermals): 92,115 92,119.5 94.5,122 96,122 96,115
  pour Top (rank 2, no thermals): 4.5,99 4.5,103 11,109.5 16.5,109.5 17.25,110.25 17.25,114.75 16.5,115.5 9.5,115.5 9.5,120.5 11,122 17,122 17.5,122.5 17.5,125.5 17,126 3,126 0.5,123.5 0.5,99
  pour Bottom: 51.5,93.5 72.5,93.5 72.5,90 46,90 46,91 46,93.5
  pour Top (no thermals): 43,106.5 43,124.5 44.5,126 48,126 48,106.5
  pour Bottom: 44.5,122.5 44.5,126 96.5,126 96.5,122.5
  pour Top (no thermals): 32.5,86 36.5,82 36.5,75.25 30.25,69 4,69 0.25,72.75 0.25,98.75 0.75,99.25 4.5,99.25 4.5,79 7.5,76 23.25,76
  pour Top (rank 2, no thermals): 29.25,82.5 43,97.75 43,106.5 43.5,107 48,107 50.25,104.75 50.25,90.5 49.75,90 46.25,90 43.25,87 43.25,82 36.5,75.25
+12V2
  Top 0.305: R23.1 35.5,103.5 33.5,101.5 22.5,101.5
  pour Top (rank 3, no thermals): 11,103.75 19,103.5 20.75,101.75 23.25,101.75 23.25,96.25 21,93.75 14.75,93.75 13.75,94.75 13.75,99 11,101.75
AM-VIN
  Top 1.016: U1.VIN 45.72,67.39 D1.C
D4
  Top 0.406: SER4.3 33.51,16.01 34,16.5 48.64,16.5 U1.D4
D5
  Top 0.406: SER3.3 30.97,16.22 32,17.25 46.85,17.25 U1.D5
D6
  Top 0.406: SER2.3 28.43,14.68 31.75,18 45.06,18 U1.D6
D8  (via drill 0.6)
  Top 0.254: v118.5,127 117.25,125.75 117.25,25.5 109.5,17.75 109.5,7.75 104.5,2.75 46,2.75 39.25,9.5 39.25,14.75 39.75,15.25 v41.5,15.25
  Top 0.305: R15.1 39.7,110.45 R4.1
  Top 0.406: v50.5,135 42.25,126.75 42.25,112 40.75,110.5 R4.1
  Bottom 0.254: v50.5,135 50.5,138 52,139.5 109.5,139.5 111.5,137.5 111.5,133.5 114.25,130.75 117.75,130.75 118.5,130 v118.5,127 | v41.5,15.25 41.66,15.41 U1.D8
D9  (via drill 0.6)
  Top 0.254: v117.5,128.5 116.75,127.75 116.75,25.75 109,18 109,8 104.25,3.25 46.25,3.25 40.25,9.25 v40.25,13.5
  Top 0.305: R14.1 39.7,120.89 R2.1
  Top 0.406: v74.75,135 71.75,138 50.25,138 41.5,129.25 41.5,121.75 40.71,120.96 R2.1
  Bottom 0.254: v74.75,135 74.75,138.25 75.25,138.75 109.25,138.75 110.75,137.25 110.75,133.25 114,130 116,130 v117.5,128.5 | v40.25,13.5 39.12,14.63 U1.D9
D10  (via drill 0.6)
  Top 0.254: v115.75,128.5 116.25,128 116.25,26 108.5,18.25 108.5,8.25 104,3.75 46.5,3.75 41,9.25 v41,11.5
  Top 0.305: R13.1 39.7,131.95 R9.1
  Top 0.406: v98.75,135.5 95.25,139 49.75,139 42.75,132 R9.1
  Bottom 0.254: v98.75,135.5 98.75,137 99.75,138 108.75,138 110,136.75 110,132.75 113.5,129.25 115,129.25 v115.75,128.5 | v41,11.5 36.58,15.92 U1.D10
D11
  Top 0.406: SER1.3 25.89,14.14 30.75,19 31.84,19 U1.D11
D16  (via drill 0.6)
  Top 0.254: v112.25,25.75 105.5,19 93,19 87.25,24.75 v84,24.75
  Bottom 0.254: EXP1.4 113.46,60.04 115,58.5 115,28.5 v112.25,25.75 | v84,24.75 75.25,24.75 73.66,23.16 U1.D16
D17  (via drill 0.6)
  Top 0.254: v112.25,24.25 111.5,24.25 105.75,18.5 92.75,18.5 87,24.25 85.75,24.25 v85,23.5
  Bottom 0.254: EXP1.3 110.44,61.25 113,61.25 115.5,58.75 115.5,27.5 v112.25,24.25 | v85,23.5 78.5,23.5 U1.D17
D23
  Top 0.254: EXP1.5 106,54.27 106,26.25 103.5,23.75 U1.D23
D25
  Top 0.254: EXP1.6 110.52,58.75 108.25,58.75 105.5,56 105.5,26.5 105.25,26.25 96.55,26.25 U1.D25
D27  (via drill 0.6)
  Top 0.254: v104.25,41.5 103,41.5 98.5,37 98.5,30.8 U1.D27
  Bottom 0.254: EXP1.7 103.25,48.98 103.25,42.5 v104.25,41.5
D29  (via drill 0.6)
  Top 0.254: v104.25,43.5 98,37.25 98,32.84 U1.D29
  Bottom 0.254: EXP1.8 110.5,53.69 110.5,49.75 v104.25,43.5
D31
  Bottom 0.254: EXP2.3 107.59,33.9 U1.D31
D33
  Bottom 0.254: EXP2.5 110.5,34.27 110.5,36.25 110,36.75 108,36.75 107.69,36.44 U1.D33
D35
  Top 0.254: EXP1.2 110.44,61.25 108.75,61.25 105,57.5 105,47.46 U1.D35
D37
  Top 0.254: EXP1.1 108.08,62.58 104.5,59 104.5,49.5 U1.D37
D41
  Bottom 0.254: EXP2.8 113.25,31.94 113.25,38.75 112,40 108,40 107,39 101.25,39 101.25,41.87 U1.D41
D49
  Bottom 0.254: EXP2.7 110.44,29.25 112.5,29.25 113.75,30.5 113.75,39 112.25,40.5 103.75,40.5 102.75,41.5 102.75,50.53 U1.D49
D53
  Top 0.254: EXP2.4 113.04,35.54 115,37.5 115,62.25 113,64.25 98.93,64.25 U1.D53
E0-DIR  (via drill 0.6)
  Top 0.254: v54.25,66 57.5,66 92.14,31.36 U1.D28
  Bottom 0.254: U$4.DIR 63.19,74.25 51.5,74.25 48.25,71 48.25,68.25 51,65.5 52.25,65.5 52.75,66 v54.25,66
E0-EN  (via drill 0.6)
  Top 0.254: R16.2 52.16,81 U$4.EN | v54.25,64 58,64 91.75,30.25 91.75,28.51 U1.D24
  Bottom 0.254: U$4.EN 47.23,67.77 50.5,64.5 52.25,64.5 52.75,64 v54.25,64
E0-STEP  (via drill 0.6)
  Top 0.254: v53,65 57.8,65 U1.D26
  Bottom 0.254: U$4.STEP 62.47,75.97 61.25,74.75 51.25,74.75 47.75,71.25 47.75,68 50.75,65 v53,65
E1-DIR  (via drill 0.6)
  Top 0.254: v72.25,64.5 72.25,60.71 U1.D34
  Bottom 0.254: U$5.DIR 86.69,73.75 71.75,73.75 71,73 71,65.75 v72.25,64.5
E1-EN  (via drill 0.6)
  Top 0.254: R17.2 76.16,81 U$5.EN | v69.5,63 69.5,62.75 92,40.25 92,35.88 U1.D30
  Bottom 0.254: U$5.EN 70,74.84 70,65.25 69.5,64.75 v69.5,63
E1-STEP  (via drill 0.6)
  Top 0.254: v70.5,64.25 71.75,65.5 73,65.5 73.25,65.25 73.25,60.5 92.23,41.52 U1.D36
  Bottom 0.254: U$5.STEP 84.65,74.25 71.5,74.25 70.5,73.25 v70.5,64.25
FAN
  Top 0.254: R26.2 63.33,57.92 91.25,30 91.25,26.47 U1.D22
GND  (via drill 0.6, 0.7)
  Top 0.254: 75.7,84 C4.- | R8.2 75.5,116.5 | R10.2 99.5,116.5 | R5.2 51.7,116.5 C7.- | LED1.C 112.18,10.68 114.75,13.25 118.16,13.25 RESET.1
  Top 0.305: R6.1 51.5,84 | R2.2 35.46,120.96 35,120.5 32.25,120.5 | R4.2 36,110.5 34.25,108.75 32.5,108.75 | R9.2 36.75,132 34.5,129.75 32.5,129.75
  Top 0.406: R3.2 75.7,84 | C12.1 C11.1 v56,28.5 | C14.1 C13.1 v68.5,28.5 | T0.2 105.5,82.27 C5.2 | T1.2 105.5,90.77 C1.2 | T2.2 105.5,99.27 C17.2 | C16.1 78.55,26.5 C15.1 v78.5,28.25 | Q4.2 43.1,58.6 43.75,59.25 v44.5,59.25 44.5,58.5 45.08,57.92 R27.1
  Top 0.61: EXP1.9 109.23,47.02 v110.5,45.75
  Bottom 6.452: 4.75,71.75 4.75,72.25
  other vias: 7.5,15.5 7.5,14.25 7.5,13 7.5,11.75 7.5,10.5 16.5,10.5 16.5,11.75 16.5,13 16.5,14.25 16.5,15.5 40.5,77 41.25,76.25 37.75,74.25 38.5,73.5 42,75.5 39.25,72.75 29.5,129.25 30.75,129.25 32,129.25 29.5,128 30.75,128 32,128 29.5,118.75 30.75,118.75 32,118.75 29.5,117.5 30.75,117.5 32,117.5 29.5,107.5 30.75,107.5 32,107.5 29.5,106.25 30.75,106.25 32,106.25
  pour Top (no thermals): 77,82.5 77,87 74.5,89.5 73,89.5 73,82.5
  pour Top (no thermals): 53,82.5 53,87 50.5,89.5 49,89.5 49,82.5
  pour Top (no thermals): 53,115 53,119.5 50.5,122 49,122 49,115
  pour Top (no thermals): 77,115 77,119.5 74.5,122 73,122 73,115
  pour Top (no thermals): 101,115 101,119.5 98.5,122 97,122 97,115
  pour Top (no thermals): 0.25,9.25 24.5,9.25 24.5,20 0.25,20
  pour Top (no thermals): 37.5,75 42.5,80 43.5,79 43.5,75.25 40.5,72.25 35,72.25 35,72.5
  pour Top (no thermals): 29,131.5 32.75,131.5 32.75,127.5 29,127.5
  pour Top (no thermals): 29,121 32.75,121 32.75,117 29,117
  pour Top (no thermals): 29,109.75 32.75,109.75 32.75,105.75 29,105.75
  pour Bottom (rank 5, no thermals): 0,72.25 93.75,72.25 93.75,104.5 120,104.5 120,140 0,140
  pour Bottom: 120.25,104 94.25,104 94.25,71.75 -0.25,71.75 -0.25,-0.25 120.25,-0.25
LED
  Top 0.254: U1.D13 29.11,21.36 R12.2
MISO  (via drill 0.6)
  Top 0.254: EXP2.1 109.23,39.23 113.5,43.5 113.5,55.75 v113,56.25
  Bottom 0.254: v113,56.25 99,56.25 97.25,58 95.28,58 U1.D50
MOSI
  Top 0.254: EXP2.6 113.75,33 115.5,34.75 115.5,62.75 113.25,65 99.25,65 97.75,66.5 93.5,66.5 92.25,65.25 92.25,61.25 93,60.5 95.32,60.5 U1.D51
N$1
  Top 0.305: LED3.C 36.25,116.25 33.75,113.75 26.5,113.75
  pour Top (no thermals): 10.25,120.25 11.25,121.25 27,121.25 27,113.5 21,113.5 17.75,116.25 10.75,116.25 10.25,116.75
N$2  (via drill 3.2 pad 6)
  other vias: 5,5
N$3
  Top 1.676: E0_MOT1.1 E0_MOT2.1 52.69,89.15 U$4.2B
N$4
  Top 1.676: E0_MOT1.2 E0_MOT2.2 55.23,89.15 U$4.2A
N$5
  Top 0.254: U$4.MS1 53.2,79.5 56,79.5 | 56,79.5 58.73,79.5 JP2.1 | R6.2 56.5,84 56,83.5 56,79.5
N$6
  Top 0.254: U$4.MS3 56.28,77.5 61.81,77.5 JP2.5
N$7
  Top 0.305: LED4.C 36.25,127.25 33.25,124.25 28,124.25
  pour Top (rank 2, no thermals): 9.5,126.75 9.5,132.5 11.25,134.25 26.75,134.25 28.25,132.75 28.25,124 18.75,124 18,124.75 18,125.75 17,126.75
N$8
  Top 0.254: U$4.RST U$4.SLP
N$9
  Top 0.254: U$4.MS2 54.74,78.5 60.27,78.5 JP2.3
N$10
  Top 1.676: U$4.1A 57.77,89.15 E0_MOT2.3 E0_MOT1.3
N$11
  Top 1.676: E0_MOT1.4 E0_MOT2.4 60.31,89.15 U$4.1B
N$12
  Top 1.676: U$5.2B 76.69,89.15 E1_MOT1.1 76.69,101.94 U$3.1
N$13
  Top 1.676: U$5.2A 79.23,89.15 E1_MOT1.2 79.23,101.98 U$3.2
N$14
  Top 0.254: U$6.MS1 53.2,112 56,112 | 56,112 58.73,112 JP4.1 | R5.1 56.5,116.5 56,116 56,112
N$15
  Top 0.254: U$6.MS2 54.74,111 60.27,111 JP4.3
N$16
  Top 1.676: U$5.1A 81.77,89.15 E1_MOT1.3 81.77,101.98 U$3.3
N$17
  Top 0.254: U$7.MS2 78.74,111 84.27,111 JP5.3
N$18
  Top 1.676: U$5.1B 84.31,89.15 E1_MOT1.4 84.31,101.94 U$3.4
N$19
  Top 0.254: U$6.MS3 56.28,110 61.81,110 JP4.5
N$20
  Top 0.254: U$6.RST U$6.SLP
N$21
  Top 1.676: X_MOT1.1 X_MOT2.1 52.69,121.65 U$6.2B
N$22
  Top 1.676: X_MOT1.2 X_MOT2.2 55.23,121.65 U$6.2A
N$23
  Top 0.254: U$7.RST U$7.SLP
N$24
  Top 0.254: U$5.RST U$5.SLP
N$25
  Top 0.254: R3.1 81.42,82.92 81,82.5 80.5,82.5 80,82 80,79.5 | 80,79.5 77.2,79.5 U$5.MS1 | JP3.1 82.73,79.5 80,79.5
N$26
  Top 1.676: X_MOT1.3 X_MOT2.3 57.77,121.65 U$6.1A
N$27
  Top 1.676: X_MOT1.4 X_MOT2.4 60.31,121.65 U$6.1B
N$28
  Top 1.676: Y_MOT1.1 Y_MOT2.1 76.69,121.65 U$7.2B
N$29
  Top 1.676: Y_MOT1.2 Y_MOT2.2 79.23,121.65 U$7.2A
N$30
  Top 1.676: Y_MOT1.3 Y_MOT2.3 81.77,121.65 U$7.1A
N$31
  Top 0.254: U$7.MS3 80.28,110 85.81,110 JP5.5
N$32
  Top 0.305: R23.2 39.75,105.7 LED2.A
N$33
  Top 0.254: U$7.MS1 77.2,112 80,112 | 80,112 82.73,112 JP5.1 | R8.1 80.5,116.5 80,116 80,112
N$34
  Top 0.254: JP3.5 85.81,77.5 80.28,77.5 U$5.MS3
N$35
  Top 0.254: JP3.3 84.27,78.5 78.74,78.5 U$5.MS2
N$36
  Top 1.676: Y_MOT1.4 Y_MOT2.4 84.31,121.65 U$7.1B
N$37
  Top 0.254: U$8.MS2 102.74,111 108.27,111 JP6.3
N$38
  Top 0.305: U$8.RST U$8.SLP
N$39
  Top 0.254: U$8.MS3 104.28,110 109.81,110 JP6.5
N$40
  Top 0.254: U$8.MS1 101.2,112 104,112 | 104,112 106.73,112 JP6.1 | R10.1 104.5,116.5 104,116 104,112
N$41
  Top 1.676: Z_MOT1.1 Z_MOT2.1 100.69,121.65 U$8.2B
N$42
  Top 1.676: Z_MOT1.2 Z_MOT2.2 103.23,121.65 U$8.2A
N$43
  Top 1.676: Z_MOT1.3 Z_MOT2.3 105.77,121.65 U$8.1A
N$44
  Top 1.676: Z_MOT1.4 Z_MOT2.4 108.31,121.65 U$8.1B
N$45
  Top 0.305: R24.2 39.75,116.2 LED3.A
N$46  (via drill 0.7)
  Top 0.254: LED1.A 111.27,14.73 v111.25,14.75 | v91.75,22.5 84.5,29.75 53.25,29.75 46.75,23.25 33.25,23.25 30.13,26.37 R12.1
  Bottom 0.254: v111.25,14.75 101.75,14.75 96.75,19.75 93,19.75 91.75,21 v91.75,22.5
N$47
  Top 0.305: Q2.1 33.72,115.47 36.75,118.5 R14.2
N$48
  Top 0.305: Q1.1 33.22,125.97 36.75,129.5 R13.2
N$49
  Top 0.305: Q3.1 32.97,104.22 36.75,108 R15.2
N$50
  Top 0.305: R25.2 39.75,127.2 LED4.A
N$51  (via drill 0.7)
  Top 0.305: LED2.C 36.25,105.75 33.25,102.75 27,102.75
  other vias: 18.75,108.5 18.75,107.25 18.75,106 18.75,104.75 18.75,109.75 20.25,110.75 21.5,110.75 22.75,110.75 24,110.75 25.25,110.75
  pour Top (rank 2, no thermals): 11.25,108.75 16.75,108.75 20.5,112 25.5,112 27,110.5 27,102.75 20.75,102.75 20.75,104.25 11,104.25 11,108.5
  pour Bottom (no thermals): 11,112 27.25,112 27.25,102.5 16.25,102.5 14.75,104 11.75,104 11,104.75
N$53
  pour Top (rank 2, no thermals): 5,96 5.5,96.5 5.5,99.75 5.75,100 12,100 13.25,98.75 13.25,94.5 14.75,93 18.75,93 19,92.75 19,89.25 18,88.25 13.5,88.25 10,91.75 6,91.75 5,92.75
N$54
  pour Top (rank 3, no thermals): 6,88 13,88 20.75,80.25 20.75,78 19.75,77 13.5,77 8,82.5 6,82.5 5,83.5 5,87
N$56  (via drill 3.2 pad 6)
  other vias: 115,5
N$57  (via drill 3.2 pad 6)
  other vias: 115,135
N$58  (via drill 3.2 pad 6)
  other vias: 5,135
N$62  (via drill 0.6)
  Top 0.406: v33.5,60.25 v5.5,60.25 | Q4.3 38,56.5 36.75,57.75 v36.75,60.25
  Bottom 0.406: v36.75,60.25 v33.5,60.25 | v5.5,60.25 1,64.75 1,128.25 3.25,130.5 7.25,130.5 10.5,133.75 23.5,133.75 25.25,135.5 FAN.2
N$63
  Top 0.406: Q4.1 46.53,55.55 R27.2 R26.1
RESET  (via drill 0.6)
  Top 0.254: v37.75,12.75 37.75,10.25 45.75,2.25 104.75,2.25 110,7.5 110,15.5 110.75,16.25 117.04,16.25 RESET.2 | v35.25,24.5 35.25,67.23 U1.RES
  Bottom 0.254: v37.75,12.75 35.25,15.25 v35.25,24.5
SCK  (via drill 0.6)
  Top 0.254: EXP2.2 114,40.31 v114,58
  Bottom 0.254: v114,58 113.25,58.75 108,58.75 106,56.75 99.25,56.75 97.75,58.25 97.75,60 97.25,60.5 95.32,60.5 U1.D52
SCL
  Top 0.254: U1.D21 86.36,17.64 90,14 98.49,14 I2C.4 98.58,14 104.25,14 105,13.25 R22.1
SDA
  Top 0.254: U1.D20 83.82,19.43 91.75,11.5 98.45,11.5 I2C.3 98.62,11.5 101.58,11.5 R21.1
THERM0
  Top 0.254: R7.1 99.58,79.58 91.5,71.5 88.4,71.5 U1.A13
  Top 0.406: T0.1 105.5,79.73 C5.1 102,79.6 R7.1
THERM1
  Top 0.254: 102,88.1 102,86.5 103.5,85 111.75,85 113.25,83.5 113.25,78.75 112,77.5 98.25,77.5 91.75,71 90.44,71 U1.A14
  Top 0.406: T1.1 105.5,88.23 C1.1 102,88.1 R1.1
THERM2
  Top 0.254: R11.1 102,95 103.75,93.25 111.75,93.25 113.75,91.25 113.75,78.5 112.25,77 98.5,77 92.5,71 92.5,70.52 U1.A15
  Top 0.406: T2.1 105.5,96.73 C17.1 102,96.6 R11.1
VCC  (via drill 0.6, 0.6 pad 1.02)  (1 unrouted)
  Top 0.254: JP3.2 83,82.31 83,81.5 82.5,81 R17.1 | U$5.VDD 86.47,86.53 87,86 JP3.4 | U$4.VDD 62.47,86.53 63,86 JP2.4 | R16.1 58.5,81 59,81.5 59,82.31 JP2.2 | R18.1 58.5,113.5 59,114 59,114.81 JP4.2 | R20.1 106.5,113.5 107,114 107,114.81 JP6.2 | R19.1 82.5,113.5 82.75,113.75 82.75,114.56 JP5.2
  Top 0.305: v102,84.5 R7.2 | v102,93.25 R1.2 | v102,101.75 R11.2
  Top 0.406: Z-MAX.1 Z-MIN.1 Y-MAX.1 Y-MIN.1 X-MAX.1 X-MIN.1
  Top 0.61: JP4.2 JP4.4 | JP4.4 JP4.6 67.25,114.56 67.25,112.75 v70,110 | JP5.2 JP5.4 | JP5.4 JP5.6 93.75,112.06 v93.75,110 v87.75,110 | JP3.6 JP3.4 JP3.2 | JP2.2 JP2.4 JP2.6 67,82.31 67,79.5 66.25,78.75 v66.25,77.5 | v114.5,110 115,110.5 115,114.81 JP6.6 JP6.4 | U$6.VDD 62.5,121.24 62.5,119 63,118.5 JP4.4 | U$7.VDD 86.47,119.78 87,119.25 JP5.4 | U$8.VDD 110.47,120.03 111,119.5 JP6.4 | JP6.2 JP6.4 | U1.5V@1 U1.5V@2 | Z-MAX.1 91.29,7.71 92.66,6.34 I2C.1 100.84,6.34 101.75,7.25 R21.2 R22.2 106.33,8.83 107,9.5 107,13.25 v103.25,17 | EXP1.10 111.77,43.77 107.25,39.25 107.25,23.5 v104.75,21
  Bottom 0.305: JP3.6 101.27,83.77 v102,84.5 v102,93.25 v102,101.75
  Bottom 0.61: U1.5V@0 46.14,77.5 v66.25,77.5 89.5,77.5 91.25,79.25 91.25,82.06 JP3.6 94.25,88.48 94.25,107 93.75,107.5 v93.75,110 v114.5,110 | v87.75,110 v70,110 | v103.25,17 100.72,17 U1.5V@2 104.55,21.2 v104.75,21
X-DIR
  Top 0.254: U$6.DIR 65.01,106.74 66,105.75 86,105.75 88,103.75 88,92.75 91.75,89 91.75,75.5 90.25,74 56,74 53.34,71.34 U1.A1
X-EN  (via drill 0.6, 0.6 pad 1.02)
  Top 0.254: R18.2 52.16,113.5 U$6.EN 51.05,104.75 85,104.75 86.5,103.25 v86.5,102.5 | v91.25,102.5 90.5,101.75 90.5,94 94.25,90.25 94.25,77.5 v95,76.75 | v89,66.25 88.75,66 88.75,64.75 89.5,64 89.5,57.75 92.5,54.75 92.5,45.54 U1.D38
  Bottom 0.254: v86.5,102.5 v91.25,102.5 | v95,76.75 92.75,74.5 92.75,68.5 90.5,66.25 v89,66.25
X-MAX
  Top 0.406: C12.2 58.42,24.47 U1.D2 58.42,16.67 56.5,14.75 X-MAX.3
X-MIN
  Top 0.406: C11.2 55.88,24.43 U1.D3 55.88,19.88 52,16 50.25,16 49,14.75 X-MIN.3
X-STEP
  Top 0.254: U$6.STEP 62.47,107.53 64.75,105.25 85.5,105.25 87.5,103.25 87.5,92.5 91.25,88.75 91.25,75.75 90,74.5 55.84,74.5 U1.A0
Y-DIR
  Top 0.254: U$7.DIR 89.01,104.99 89.5,104.5 89.5,93.5 93.25,89.75 93.25,74.75 91,72.5 69,72.5 68.58,72.08 U1.A7
Y-EN
  Top 0.254: R19.2 76.16,113.5 U$7.EN 71.23,107.27 72.25,106.25 86.25,106.25 88.5,104 88.5,93 92.25,89.25 92.25,75.25 90.5,73.5 56.25,73.5 55.88,73.13 U1.A2
Y-MAX
  Top 0.406: C14.2 71.12,24.43 U1.D15 71.12,13.17 Y-MAX.3
Y-MIN
  Top 0.406: C13.2 68.58,24.47 U1.D14 68.58,19.08 64,14.5 Y-MIN.3
Y-STEP
  Top 0.254: U$7.STEP 86.47,106.78 89,104.25 89,93.25 92.75,89.5 92.75,75 90.75,73 68.25,73 66.04,70.79 U1.A6
Z-DIR  (via drill 0.6, 0.6 pad 1.02)
  Top 0.254: U$8.DIR 110.94,106.5 97.5,106.5 91.5,100.5 91.5,94.5 95.25,90.75 95.25,80.25 v95.75,79.75 | v91,64 90.5,63.5 90.5,58.5 92.25,56.75 U1.D48
  Bottom 0.254: v95.75,79.75 96.5,79 96.5,76 93.75,73.25 93.75,68 91,65.25 v91,64
Z-EN
  Top 0.254: R20.2 100.16,113.5 U$8.EN 90,103.34 90,93.75 93.75,90 93.75,74.5 91.25,72 74.75,72 73.66,70.91 U1.A8
Z-MAX
  Top 0.406: Z-MAX.3 86.5,14.5 81.28,19.72 U1.D19 81.28,24.58 C16.2
Z-MIN
  Top 0.406: C15.2 78.74,24.31 U1.D18 78.74,13.05 Z-MIN.3
Z-STEP  (via drill 0.6, 0.6 pad 1.02)
  Top 0.254: U$8.STEP 108.9,107 97.25,107 91,100.75 91,94.25 94.75,90.5 94.75,78.75 v95.25,78.25 | v90,65 90,58.2 U1.D46
  Bottom 0.254: v95.25,78.25 96,77.5 96,76.25 93.25,73.5 93.25,68.25 v90,65

### Text on the board
tPlace: FAN | CFAN | 100K | + | + | 10R | 1.8K | 100K | 10R | 100K | 100K | 100K | 1.8K | 100K | 10K | 10K | 10K | EN | DIR | EN | DIR | EN | DIR | 10R | 1.8K | 4.7K | 10u | 4.7K | 10u | 100K | 100K | 100n | THERMISTORS | 4.7K | 10K | 10K | 10u | EN | DIR | EN | DIR | 100K | 10R | MEGA | Arduino | SMART CONTROLLER | 1K | 100n | 100n | 100n | 100n | 100n | 100n | 4.7K | 4.7K | SERVOS | ENDSTOPS | I2C
tNames: X | Y | Z | D10 | + | Extr. 1 | D9 | MS1 | MS2 | MS3 | MS1 | MS2 | MS3 | MS1 | MS2 | MS3 | + | Extr. 2 | Fan | D8 | Heatbed | + | E0 | E1 | 11A | MS1 | MS2 | MS3 | MS1 | MS2 | MS3 | 5A | S | S | +
bNames: + | + | + | +
Document: RAMPS 1.4.2.1 (RepRap Arduino MEGA Pololu Shield) | GPL v3 | reprap.org/wiki/RAMPS1.4 | Reversing input power, and inserting stepper drivers incorrectly will destroy electronics. | I2C | 21 | 20 | 12-35V Out | GND | 5V | - | D10 | + | AUX-4 | D16 | - | D17 | D9 | + | D23 | D25 | - | D11 | D27 | + | D29 | D31 | 12-35VDC In | D33 | + | D35 | 11A | D37 | - | D38 | D41 | + | 5A | D43 | - | D45 | SERVOS | AUX-1 | AUX-2 | AUX-3 / SPI | D11 | D6 | D5 | D4 | D47 | A9 | A11 | SCK | MISO | D32 | 5V | GND | D2 | D1 | GND | D63 | D48 | D42 | D65 | GND | D52 | D50 | 5V | 5V | 5V | 5V | 5V | GND | 5V | GND | A3 | A4 | 5V | A5 | A10 | D44 | A12 | NC | D53 | MOSI | D49 | D57 | D58 | D59 | D64 | D66 | D51 | 5V | GND | GND | GND | GND | Copyright 2011 Johnny Russell - UltiMachine
_tsilk: + | I2C | END STOPS | 21 | 1 | 20 | 1 | - | + | 1 | + | 1 | 1 | 1 | 1 | 1 | 1 | 1 | -